# Altium schematic sheet 04_HDMII_TX.SchDoc
size 297 x 209 mm
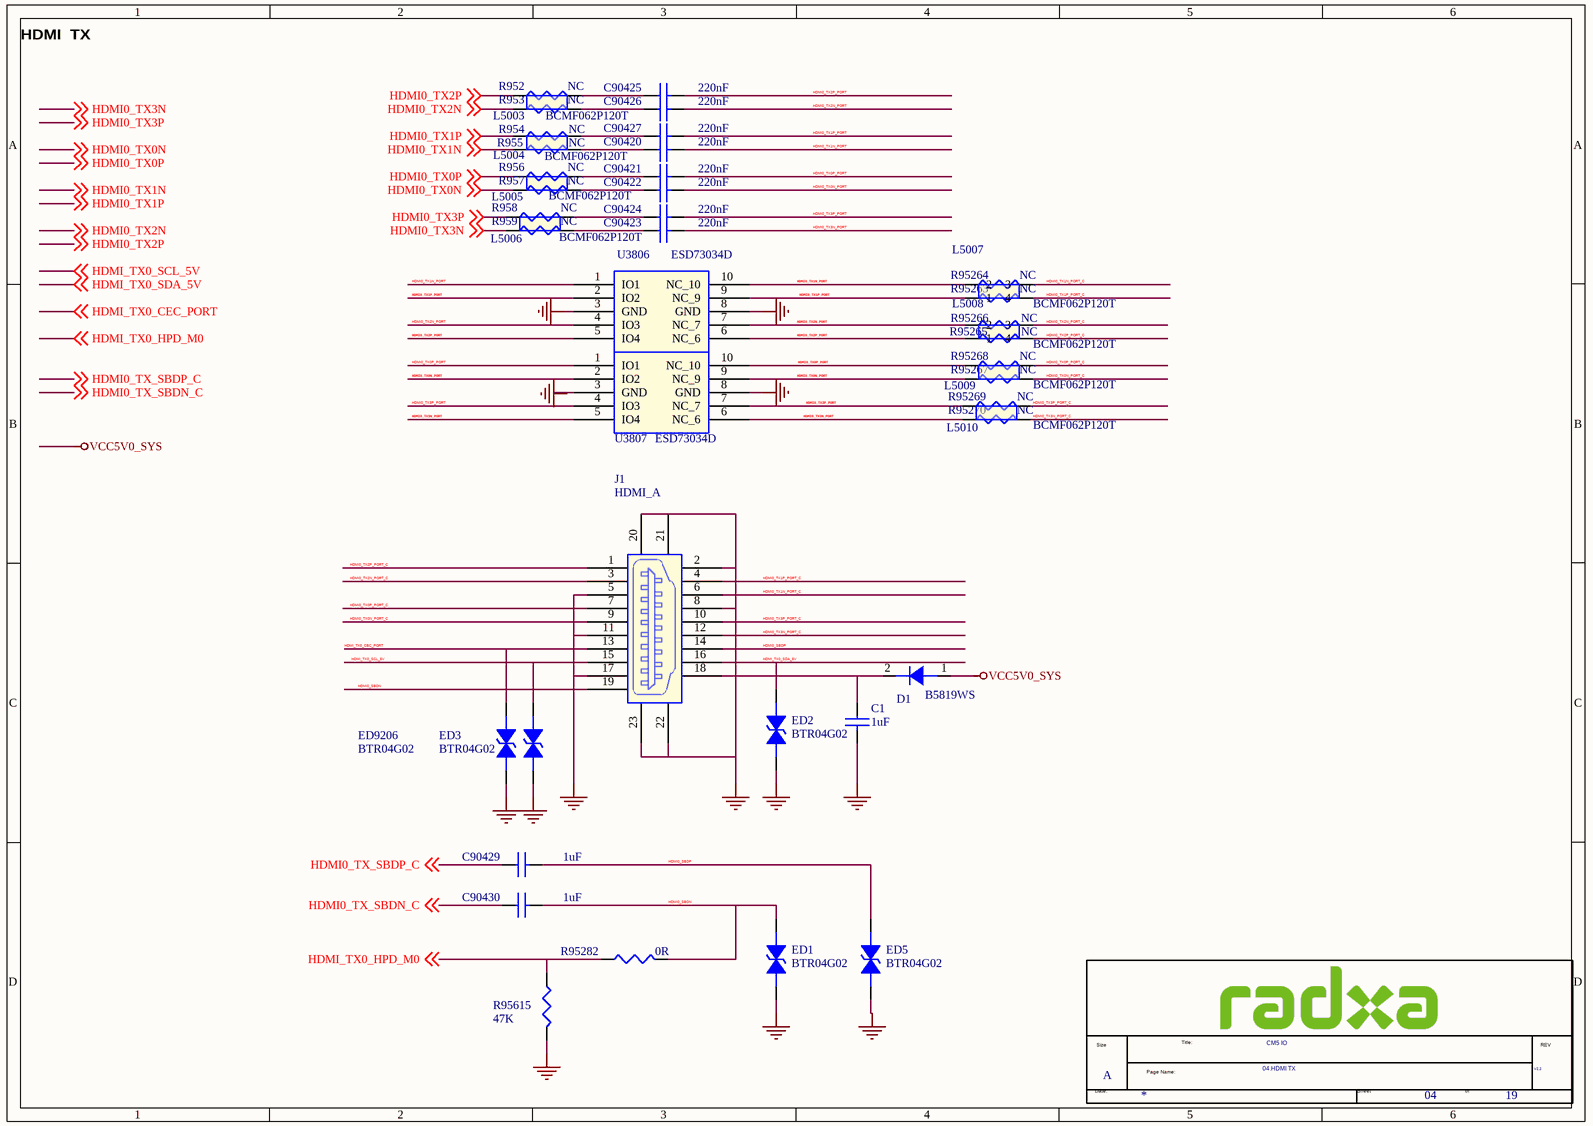
[diagram p0: 04_HDMII_TX.SchDoc]

## Parts
*  Doc: 04.HDMI TX  RevCode: V2.2  Title: CM5 IO  Page Size: A  Page Number: 04  Page Count: 19  (hidden comment: radxa_1010)  (graphical)
C1  1uF  [C0402]
C90420  220nF  [C0201]
C90421  220nF  [C0201]
C90422  220nF  [C0201]
C90423  220nF  [C0201]
C90424  220nF  [C0201]
C90425  220nF  [C0201]
C90426  220nF  [C0201]
C90427  220nF  [C0201]
C90429  1uF  [C0201]
C90430  1uF  [C0201]
D1  B5819WS  [SOD_323]
ED1  BTR04G02  [ESD0402_1xD5]
ED2  BTR04G02  [ESD0402_1xD5]
ED3  BTR04G02  [ESD0402_1xD5]
ED5  BTR04G02  [ESD0402_1xD5]
ED9206  BTR04G02  [ESD0402_1xD5]
J1  HDMI_A  [HDMIA19S]
L5003  BCMF062P120T  [MCZ1210AH900L2]
L5004  BCMF062P120T  [MCZ1210AH900L2]
L5005  BCMF062P120T  [MCZ1210AH900L2]
L5006  BCMF062P120T  [MCZ1210AH900L2]
L5007  BCMF062P120T  [MCZ1210AH900L2]
L5008  BCMF062P120T  [MCZ1210AH900L2]
L5009  BCMF062P120T  [MCZ1210AH900L2]
L5010  BCMF062P120T  [MCZ1210AH900L2]
R952  NC  [R0402]
R953  NC  [R0402]
R954  NC  [R0402]
R955  NC  [R0402]
R956  NC  [R0402]
R957  NC  [R0402]
R958  NC  [R0402]
R959  NC  [R0402]
R95263  NC  [R0402]
R95264  NC  [R0402]
R95265  NC  [R0402]
R95266  NC  [R0402]
R95267  NC  [R0402]
R95268  NC  [R0402]
R95269  NC  [R0402]
R95270  NC  [R0402]
R95282  0R  [R0402]
R95615  47K  [R0402]
U3806  ESD73034D  [SON10_2R50X1R00X0R50]
U3807  ESD73034D  [SON10_2R50X1R00X0R50]

## Nets
GND: C1.2 ED1.2 ED2.2 ED3.2 ED5.2 ED9206.2 J1.2 J1.5 J1.8 J1.11 J1.17 J1.20 J1.21 J1.22 J1.23 R95615.2 U3806.3(GND) U3806.8(GND) U3807.8(GND)
VCC5V0_SYS: D1.1(A)
HDMI0_SBDN: C90430.2 ED1.1 J1.19 R95282.2
HDMI0_SBDP: C90429.2 ED5.1 J1.14
HDMI0_TX0N: L5005.2 R957.1 ; off-sheet HDMI0_TX0N
HDMI0_TX0N_PORT: C90422.2 L5009.2 R95267.1 U3807.2(IO2) U3807.9(NC_9)
HDMI0_TX0N_PORT_C: J1.9 L5009.3 R95267.2
HDMI0_TX0P: L5005.1 R956.1 ; off-sheet HDMI0_TX0P
HDMI0_TX0P_PORT: C90421.2 L5009.1 R95268.1 U3807.1(IO1) U3807.10(NC_10)
HDMI0_TX0P_PORT_C: J1.7 L5009.4 R95268.2
HDMI0_TX1N: L5004.2 R955.1 ; off-sheet HDMI0_TX1N
HDMI0_TX1N_PORT: C90420.2 L5007.2 R95264.1 U3806.1(IO1) U3806.10(NC_10)
HDMI0_TX1N_PORT_C: J1.6 L5007.3 R95264.2
HDMI0_TX1P: L5004.1 R954.1 ; off-sheet HDMI0_TX1P
HDMI0_TX1P_PORT: C90427.2 L5007.1 R95263.1 U3806.2(IO2) U3806.9(NC_9)
HDMI0_TX1P_PORT_C: J1.4 L5007.4 R95263.2
HDMI0_TX2N: L5003.2 R953.1 ; off-sheet HDMI0_TX2N
HDMI0_TX2N_PORT: C90426.2 L5008.2 R95266.1 U3806.4(IO3) U3806.7(NC_7)
HDMI0_TX2N_PORT_C: J1.3 L5008.3 R95266.2
HDMI0_TX2P: L5003.1 R952.1 ; off-sheet HDMI0_TX2P
HDMI0_TX2P_PORT: C90425.2 L5008.1 R95265.1 U3806.5(IO4) U3806.6(NC_6)
HDMI0_TX2P_PORT_C: J1.1($PIN0) L5008.4 R95265.2
HDMI0_TX3N: L5006.2 R959.1 ; off-sheet HDMI0_TX3N
HDMI0_TX3N_PORT: C90423.2 L5010.2 R95270.1 U3807.5(IO4) U3807.6(NC_6)
HDMI0_TX3N_PORT_C: J1.12 L5010.3 R95270.2
HDMI0_TX3P: L5006.1 R958.1 ; off-sheet HDMI0_TX3P
HDMI0_TX3P_PORT: C90424.2 L5010.1 R95269.1 U3807.4(IO3) U3807.7(NC_7)
HDMI0_TX3P_PORT_C: J1.10 L5010.4 R95269.2
HDMI0_TX_SBDN_C: C90430.1 ; off-sheet HDMI0_TX_SBDN_C
HDMI0_TX_SBDP_C: C90429.1 ; off-sheet HDMI0_TX_SBDP_C
HDMI_TX0_CEC_PORT: ED9206.1 J1.13 ; off-sheet HDMI_TX0_CEC_PORT
HDMI_TX0_HPD_M0: R95282.1 R95615.1 ; off-sheet HDMI_TX0_HPD_M0
HDMI_TX0_SCL_5V: ED3.1 J1.15 ; off-sheet HDMI_TX0_SCL_5V
HDMI_TX0_SDA_5V: ED2.1 J1.16 ; off-sheet HDMI_TX0_SDA_5V
NetC1_1: C1.1 D1.2(K) J1.18
NetC90420_1: C90420.1 L5004.3 R955.2
NetC90421_1: C90421.1 L5005.4 R956.2
NetC90422_1: C90422.1 L5005.3 R957.2
NetC90423_1: C90423.1 L5006.3 R959.2
NetC90424_1: C90424.1 L5006.4 R958.2
NetC90425_1: C90425.1 L5003.4 R952.2
NetC90426_1: C90426.1 L5003.3 R953.2
NetC90427_1: C90427.1 L5004.4 R954.2

Not connected (* = marked no-connect by the designer): U3807 3(GND)

## Notes on the sheet
- HDMI  TX
- Labels drawn without touching a wire or pin: GND
- (in symbol radxa_1010) Size; Title:; REV; Page Name:; Date:; Sheet; of

## Library data of the parts
C1 = CAP NP_0: cap,1.00uF,+/-10%,10V,X5R,C0402; Manufacturer: TDK; RK PN: C1005X5R1A105K050BB; Priority: A; Tolerance: 10%; Voltage: 10V; PCB Footprint: C0402; Dielectric: X5R; Part Type: C0402; Manufacturer PN: C1005X5R1A105K050BB; Created by: JJJ
C90420-C90424 C90427 = CAP NP_0_Dup5: cap,220.00nF,+/-10%,10V,X5R,C0201; Manufacturer: TDK; RK PN: C0603X5R1A224K030BB; Priority: A; Tolerance: 10%; Voltage: 10V; PCB Footprint: C0201; Dielectric: X5R; Part Type: C0201; Manufacturer PN: C0603X5R1A224K030BB; Created by: JJJ
C90425 C90426 = CAP NP_0_Dup5: cap,220.00nF,+/-10%,10V,X5R,C0201; Manufacturer PN: C0603X5R1A224K030BB; Manufacturer: TDK; Tolerance: 10%; Priority: A; Voltage: 10V; PCB Footprint: C0201; Dielectric: X5R; Created by: JJJ; Part Type: C0201; RK PN: C0603X5R1A224K030BB
C90429 C90430 = CAP NP_0_Dup5: cap,1.00uF,+/-10%,10V,X5R,C0402; Manufacturer PN: C1005X5R1A105K050BB; Manufacturer: TDK; Tolerance: 10%; Priority: A; Voltage: 10V; PCB Footprint: C0201; Dielectric: X5R; Created by: JJJ; Part Type: C0402; RK PN: C1005X5R1A105K050BB
D1 = DIODE_Dup1: Schottky Barrier，B5819WS SOD-323; Manufacturer: 长电; Priority: A; PCB Footprint: SOD_323; Created by: JJJ; Manufacturer PN: B5819WS; Part Type: Schottky rectifier; RK PN: B5819WS
ED1 ED2 = DIODE BI_DIR TRIG_2: 1-Line, Bi-directional, Transient Voltage Suppressors.17.5pF.; Manufacturer PN: ESD5451N; Manufacturer: WillSemi(韦尔半导体); Priority: A; PCB Footprint: ESD0402_1xD5; Created by: JJJ; Part Type: ESD_TVS; RK PN: ESD5451N
ED3 ED5 ED9206 = DIODE BI_DIR TRIG_2: 1-Line, Bi-directional, Transient Voltage Suppressors.17.5pF.; Manufacturer: WillSemi(韦尔半导体); RK PN: ESD5451N; Priority: A; PCB Footprint: ESD0402_1xD5; Part Type: ESD_TVS; Manufacturer PN: ESD5451N; Created by: JJJ
J1 = HDMI_A: 通用A型HDMI座,卧式,侧插; Manufacturer: 旺科达; Priority: A; PCB Footprint: HDMIA19S; Created by: JJJ; Manufacturer Part Number: HDMI_A; Part Type: HDMI Jack; RK PN: HDMI_A
L5003-L5006 L5009 L5010 = MCZ1210AH900L2_2: PCB Footprint: SMD_TCM0605T
L5007 = MCZ1210AH900L2_0: PCB Footprint: SMD_TCM0605T
L5008 = MCZ1210AH900L2_1: PCB Footprint: SMD_TCM0605T
R952-R959 R95264 = RESISTOR_1_Dup1: 通用厚膜电阻,1K2,+/-5%,R0402,1/16W.; Manufacturer PN: RC0402JR-071K2L; Manufacturer: YAGEO; PCB Footprint: r0201; Tolerance: 5%; Wattage: 1/16W; Priority: A; Created by: YTL; Part Type: 通用厚膜电阻; RK PN: RC0402JR-071K2L
R95263 R95265-R95270 = RESISTOR_1_Dup1: 通用厚膜电阻,1K2,+/-5%,R0402,1/16W.; Manufacturer: YAGEO; PCB Footprint: r0201; Tolerance: 5%; RK PN: RC0402JR-071K2L; Priority: A; Wattage: 1/16W; Part Type: 通用厚膜电阻; Manufacturer PN: RC0402JR-071K2L; Created by: YTL
R95282 = RESISTOR_0_Dup2: 通用厚膜电阻,1K2,+/-5%,R0402,1/16W.; Manufacturer: YAGEO; Tolerance: 5%; RK PN: RC0402JR-071K2L; Priority: A; Wattage: 1/16W; PCB Footprint: R0402; Part Type: 通用厚膜电阻; Manufacturer PN: RC0402JR-071K2L; Created by: YTL
R95615 = RESISTOR_0_Dup4: 通用厚膜电阻,2K49,+/-1%,R0402,1/16W.; Manufacturer PN: RC0402FR-072K49L; Manufacturer: YAGEO; Tolerance: 1%; Wattage: 1/16W; Priority: A; PCB Footprint: R0402; Created by: YTL; Part Type: 通用厚膜电阻; RK PN: RC0402FR-072K49L
U3806 U3807 = ESD_ESD73034D: 4-Lines, Bi-directional, Ultra-low Capacitance Transient Voltage Suppressors; Manufacturer: WillSemi(韦尔半导体); Priority: A; PCB Footprint: SON10_2R50X1R00X0R50; RK PN: ESD73034D; Part Type: ESD_TVS; Manufacturer PN: ESD73034D; Created by: YWQ
* = radxa_1010: Page Create Date: March  8, 1995; Page Modify Date: *